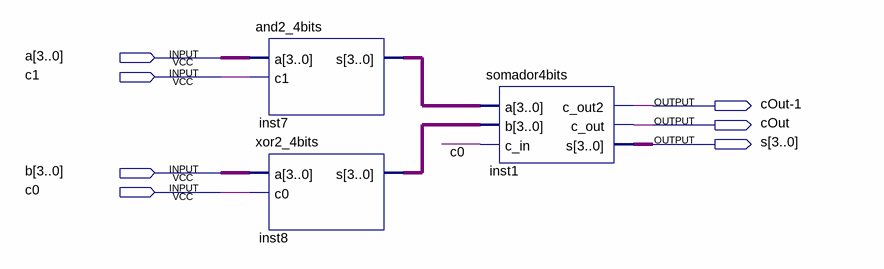
[diagram p0: schematic sheet]
// Quartus schematic ulaAux.bdf as structural Verilog: 3 symbols, 7 pins
module ulaAux (
  input  [3:0] a,
  input  c1,
  input  [3:0] b,
  input  c0,
  output \cOut-1 ,
  output cOut,
  output [3:0] s
);

  wire [3:0] inst7_s, inst8_s;

  and2_4bits inst7 (.a(a), .c1(c1), .s(inst7_s));
  xor2_4bits inst8 (.a(b), .c0(c0), .s(inst8_s));
  somador4bits inst1 (.a(inst7_s), .b(inst8_s), .c_in(c0), .c_out2(\cOut-1 ), .c_out(cOut), .s(s));
endmodule
